# Altium schematic sheet Fri3D_2026_ESP32.SchDoc: ESP32-S3 Module
size A3; Date: 23/05/2025; DrawnBy: Wim Van Gool; DocumentNumber: 2; Revision: 00; SheetNumber: 2; SheetTotal: 4
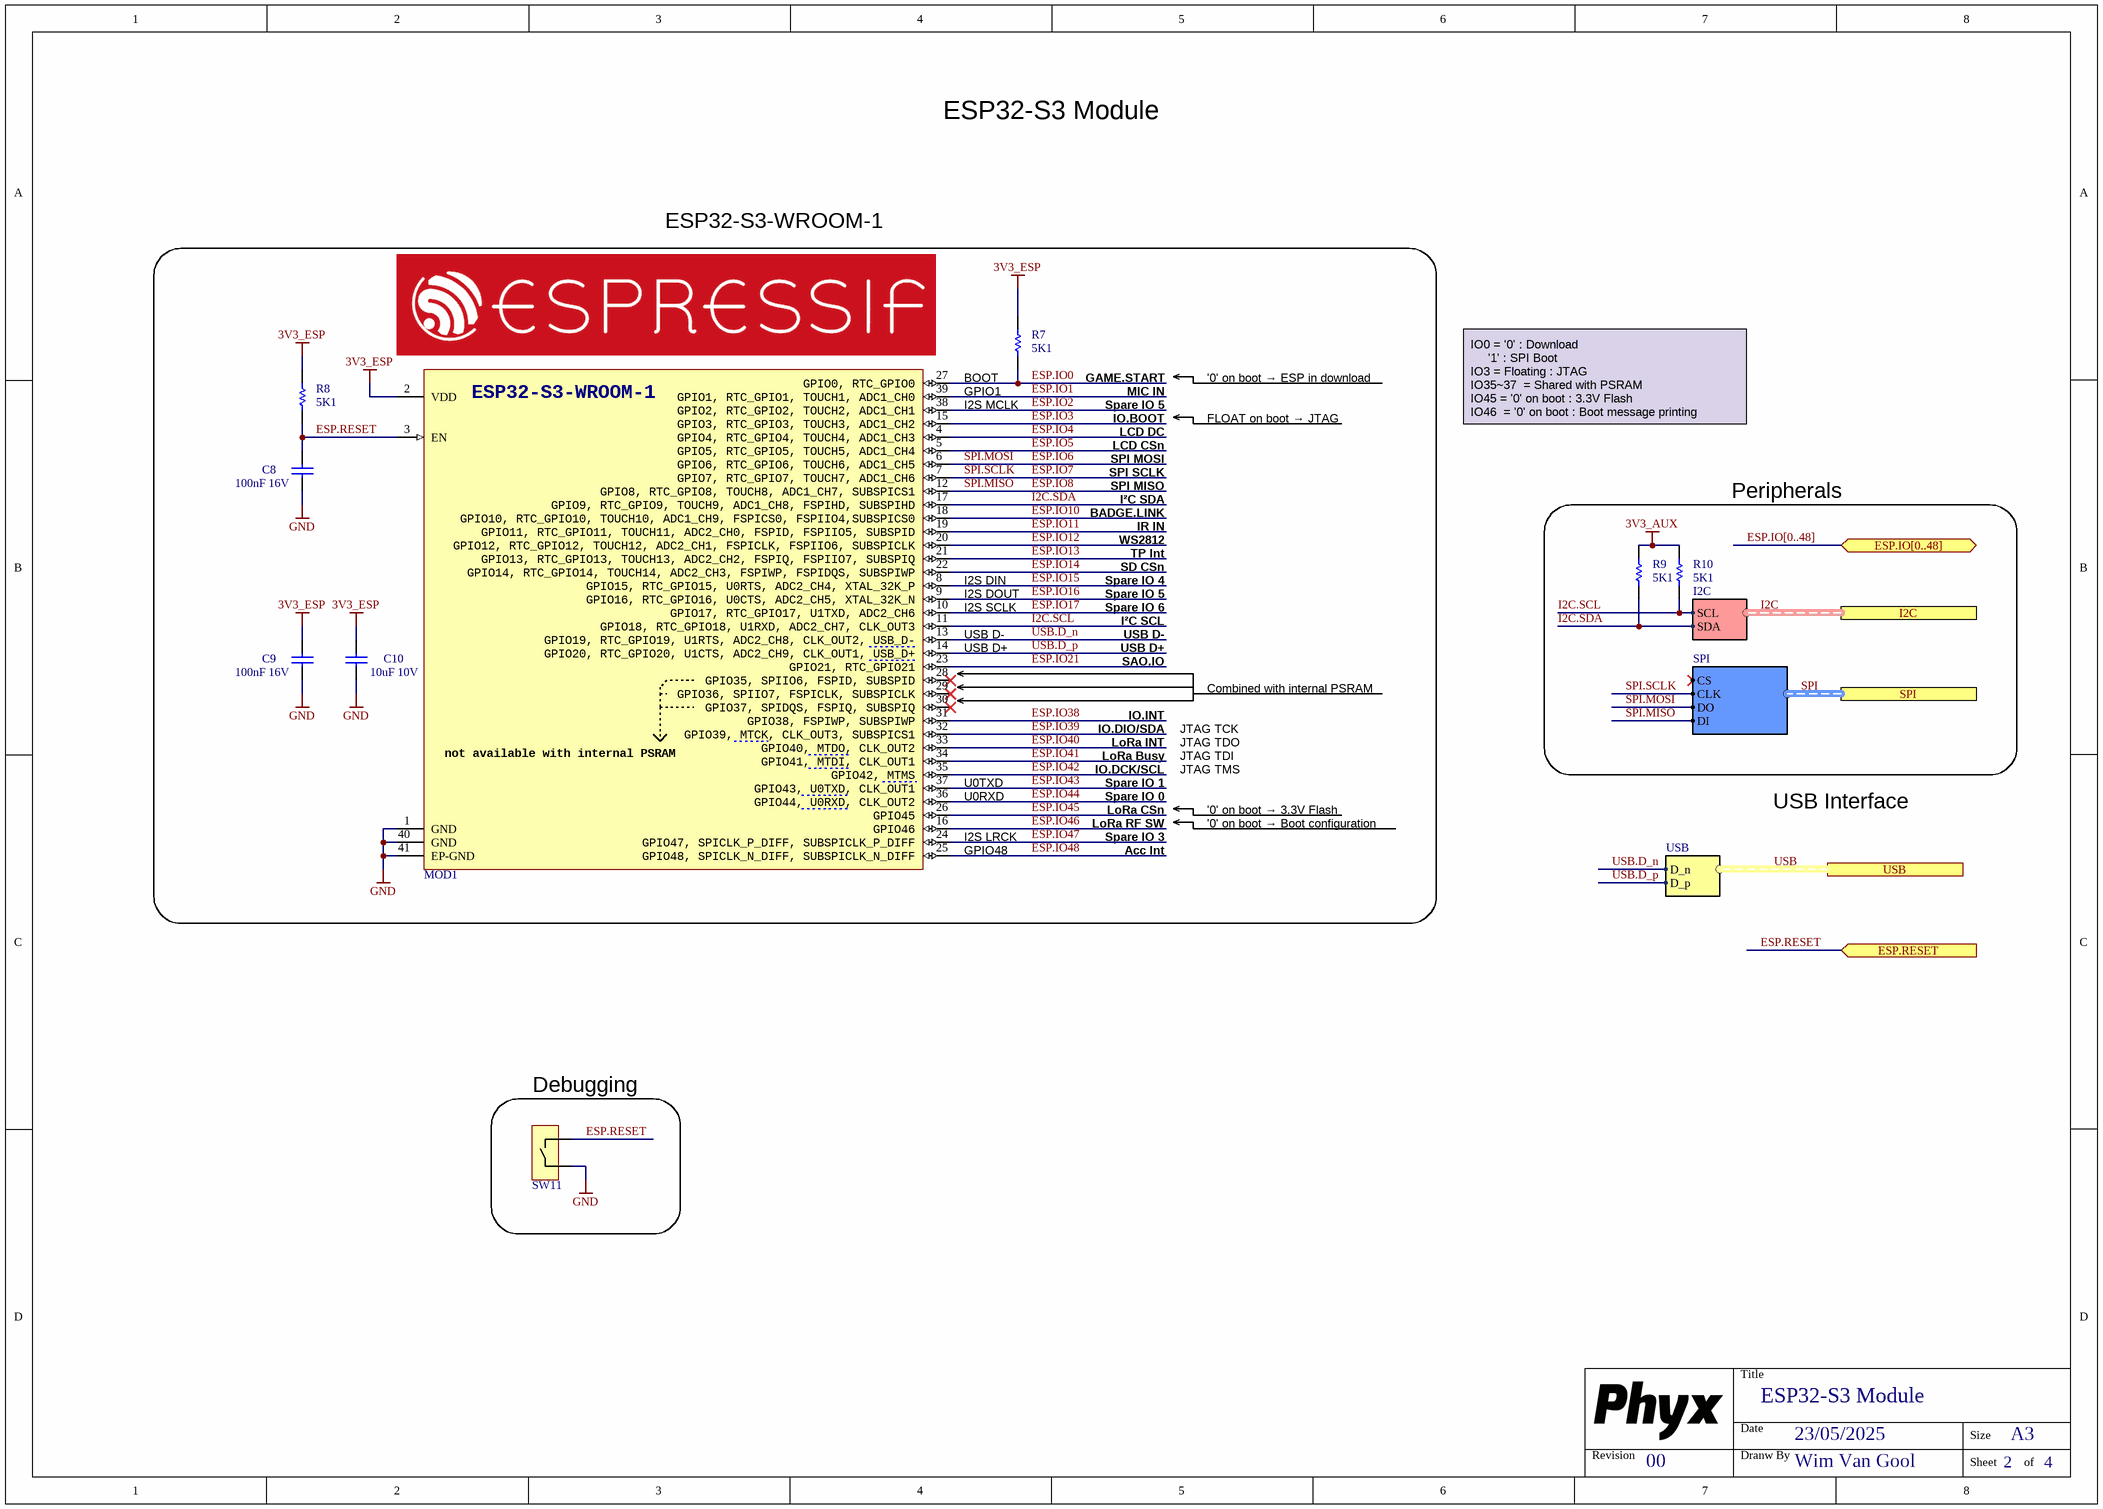
[diagram p0: Fri3D_2026_ESP32.SchDoc]

## Parts
C8  value 100nF 16V  [C0603_N]
C9  value 100nF 16V  [C0603_N]
C10  value 10uF 10V  [C0805_N]
MOD1  ESP32-S3 based WROOM-1 16MB Flash, 8MB PSRAM  [ESP-ESP32-S3-WROOM-1]  (value not drawn)
R7  value 5K1  [R0603_N]
R8  value 5K1  [R0603_N]
R9  value 5K1  [R0603_N]
R10  value 5K1  [R0603_N]
SW11  4.5x4.5mm tact SMD H3,8mm  [WE_430181038816]  (value not drawn)

## Blocks framed on the sheet
ESP32-S3-WROOM-1: C8-C10 MOD1 R7 R8
Peripherals: R9 R10
Debugging: SW11

## Ports
ESP.IO[0..48] (bidir), ESP.RESET (in), I2C (harness I2C), SPI (harness SPI), USB (harness USB)

## Harnesses
I2C: SDA, SCL
USB: D_p, D_n
SPI: CS, CLK, DO, DI

## Nets
3V3_AUX: R9.1 R10.1
3V3_ESP: C9.1 C10.1 MOD1.2(VDD) R7.1 R8.1
GND: C8.2 C9.2 C10.2 MOD1.1(GND) MOD1.40(GND) MOD1.41(EP-GND) SW11.2
ESP.IO0: MOD1.27(GPIO0,_RTC_GPIO0) R7.2
ESP.IO1: MOD1.39(GPIO1,_RTC_GPIO1,_TOUCH1,_ADC1_CH0)
ESP.IO2: MOD1.38(GPIO2,_RTC_GPIO2,_TOUCH2,_ADC1_CH1)
ESP.IO3: MOD1.15(GPIO3,_RTC_GPIO3,_TOUCH3,_ADC1_CH2)
ESP.IO4: MOD1.4(GPIO4,_RTC_GPIO4,_TOUCH4,_ADC1_CH3)
ESP.IO5: MOD1.5(GPIO5,_RTC_GPIO5,_TOUCH5,_ADC1_CH4)
ESP.IO6: MOD1.6(GPIO6,_RTC_GPIO6,_TOUCH6,_ADC1_CH5) ; port SPI.DO  [also labelled SPI.MOSI]
ESP.IO7: MOD1.7(GPIO7,_RTC_GPIO7,_TOUCH7,_ADC1_CH6) ; port SPI.CLK  [also labelled SPI.SCLK]
ESP.IO8: MOD1.12(GPIO8,_RTC_GPIO8,_TOUCH8,_ADC1_CH7,_SUBSPICS1) ; port SPI.DI  [also labelled SPI.MISO]
ESP.IO10: MOD1.18(GPIO10,_RTC_GPIO10,_TOUCH10,_ADC1_CH9,_FSPICS0,_FSPIIO4,SUBSPICS0)
ESP.IO11: MOD1.19(GPIO11,_RTC_GPIO11,_TOUCH11,_ADC2_CH0,_FSPID,_FSPIIO5,_SUBSPID)
ESP.IO12: MOD1.20(GPIO12,_RTC_GPIO12,_TOUCH12,_ADC2_CH1,_FSPICLK,_FSPIIO6,_SUBSPICLK)
ESP.IO13: MOD1.21(GPIO13,_RTC_GPIO13,_TOUCH13,_ADC2_CH2,_FSPIQ,_FSPIIO7,_SUBSPIQ)
ESP.IO14: MOD1.22(GPIO14,_RTC_GPIO14,_TOUCH14,_ADC2_CH3,_FSPIWP,_FSPIDQS,_SUBSPIWP)
ESP.IO15: MOD1.8(GPIO15,_RTC_GPIO15,_U0RTS,_ADC2_CH4,_XTAL_32K_P)
ESP.IO16: MOD1.9(GPIO16,_RTC_GPIO16,_U0CTS,_ADC2_CH5,_XTAL_32K_N)
ESP.IO17: MOD1.10(GPIO17,_RTC_GPIO17,_U1TXD,_ADC2_CH6)
ESP.IO21: MOD1.23(GPIO21,_RTC_GPIO21)
ESP.IO38: MOD1.31(GPIO38,_FSPIWP,_SUBSPIWP)
ESP.IO39: MOD1.32(GPIO39,_MTCK,_CLK_OUT3,_SUBSPICS1)
ESP.IO40: MOD1.33(GPIO40,_MTDO,_CLK_OUT2)
ESP.IO41: MOD1.34(GPIO41,_MTDI,_CLK_OUT1)
ESP.IO42: MOD1.35(GPIO42,_MTMS)
ESP.IO43: MOD1.37(GPIO43,_U0TXD,_CLK_OUT1)
ESP.IO44: MOD1.36(GPIO44,_U0RXD,_CLK_OUT2)
ESP.IO45: MOD1.26(GPIO45)
ESP.IO46: MOD1.16(GPIO46)
ESP.IO47: MOD1.24(GPIO47,_SPICLK_P_DIFF,_SUBSPICLK_P_DIFF)
ESP.IO48: MOD1.25(GPIO48,_SPICLK_N_DIFF,_SUBSPICLK_N_DIFF)
ESP.RESET: C8.1 MOD1.3(EN) R8.2 SW11.1 ; port ESP.RESET
I2C.SCL: MOD1.11(GPIO18,_RTC_GPIO18,_U1RXD,_ADC2_CH7,_CLK_OUT3) R10.2 ; port I2C.SCL
I2C.SDA: MOD1.17(GPIO9,_RTC_GPIO9,_TOUCH9,_ADC1_CH8,_FSPIHD,_SUBSPIHD) R9.2 ; port I2C.SDA
USB.D_n: MOD1.13(GPIO19,_RTC_GPIO19,_U1RTS,_ADC2_CH8,_CLK_OUT2,_USB_D-) ; port USB.D_n
USB.D_p: MOD1.14(GPIO20,_RTC_GPIO20,_U1CTS,_ADC2_CH9,_CLK_OUT1,_USB_D+) ; port USB.D_p

Not connected (* = marked no-connect by the designer): MOD1 28(GPIO35,_SPIIO6,_FSPID,_SUBSPID)* 29(GPIO36,_SPIIO7,_FSPICLK,_SUBSPICLK)* 30(GPIO37,_SPIDQS,_FSPIQ,_SUBSPIQ)*

## Buses and harness runs
bus ESP.IO[0..48] = port ESP.IO[0..48]
harness I2C = port I2C
harness SPI = port SPI
harness USB = port USB

## Notes on the sheet
- BOOT
- GPIO1
- GAME.START
- MIC IN
- '0' on boot → ESP in download
- I2S MCLK
- SPI MOSI
- LCD CSn
- LCD DC
- IO.BOOT
- Spare IO 5
- FLOAT on boot → JTAG
- IO0	= '0' : Download
  '1' : SPI Boot
  IO3	= Floating : JTAG
  IO35~37 	= Shared with PSRAM
  IO45	= '0' on boot : 3.3V Flash
  IO46 	= '0' on boot : Boot message printing
- SPI MISO
- SPI SCLK
- I²C SDA
- IR IN
- BADGE.LINK
- (near MOD1) I2S DIN
- (near MOD1) I2S DOUT
- Spare IO 4
- WS2812
- SD CSn
- TP Int
- (near MOD1) USB D-
- (near MOD1) USB D+
- (near MOD1) I2S SCLK
- USB D-
- USB D+
- I²C SCL
- Spare IO 6
- SAO.IO
- IO.DIO/SDA
- IO.INT
- JTAG TCK
- Combined with internal PSRAM
- (near MOD1) U0TXD
- (near MOD1) U0RXD
- IO.DCK/SCL
- Spare IO 1
- Spare IO 0
- LoRa INT
- LoRa Busy
- JTAG TDO
- JTAG TDI
- JTAG TMS
- (near MOD1) GPIO48
- (near MOD1) I2S LRCK
- Acc Int
- LoRa RF SW
- Spare IO 3
- LoRa CSn
- '0' on boot → 3.3V Flash
- '0' on boot → Boot configuration
- USB Interface
- Title
- Revision
- Date
- Dranw By
- Size
- A3
- Sheet
- of
- (in symbol WiFi # MOD ESP32-S3-WROOM-1-N16R8) ESP32-S3-WROOM-1; not available with internal PSRAM

## Library data of the parts
C8 C9 = CAP # 100nF 16V 0603: Capacitor Ceramic; Supplier 1: LCSC; Supplier 3: Generic; Supplier Part Number 1: C282519; Supplier Part Number 3: 100nF 16V 0603 X7R
C10 = CAP # 10uF 10V 0805: Capacitor Ceramic; Supplier 1: Farnell; Supplier Part Number 1: 2320859; Supplier 2: LCSC; Supplier 3: Generic; Supplier Part Number 2: C17024; Supplier Part Number 3: 10uF 10V 0805 X7R
MOD1 = WiFi # MOD ESP32-S3-WROOM-1-N16R8: WiFi # MOD ESP32-S3-WROOM-1; Value: ESP32-S3-WROOM-1-N16R8; Supplier 1: Espressif; Supplier Part Number 1: ESP32-S3-WROOM-1-N16R8; Supplier 2: Digi-key; Supplier Part Number 2: 1965-ESP32-S3-WROOM-1-N16R8DKR-ND
R7-R10 = RES # 5K1 0603: Supplier 1: Farnell; Supplier Part Number 1: 2845922; Supplier 2: LCSC; Supplier 3: Generic; Supplier Part Number 2: C112314; Supplier Part Number 3: 5K1 1% 0603
SW11 = SW # TACT small 4.5x4.5mm SMD WS-TASV: Value: 430181038816; Supplier 1: Wurth; Supplier Part Number 1: 430181038816; Supplier 2: Mouser; Supplier Part Number 2: 710-430181038816; Supplier 3: LCSC; Supplier Part Number 3: C174049